# EAGLE schematic untitledfonte2 (EAGLE 6.2)
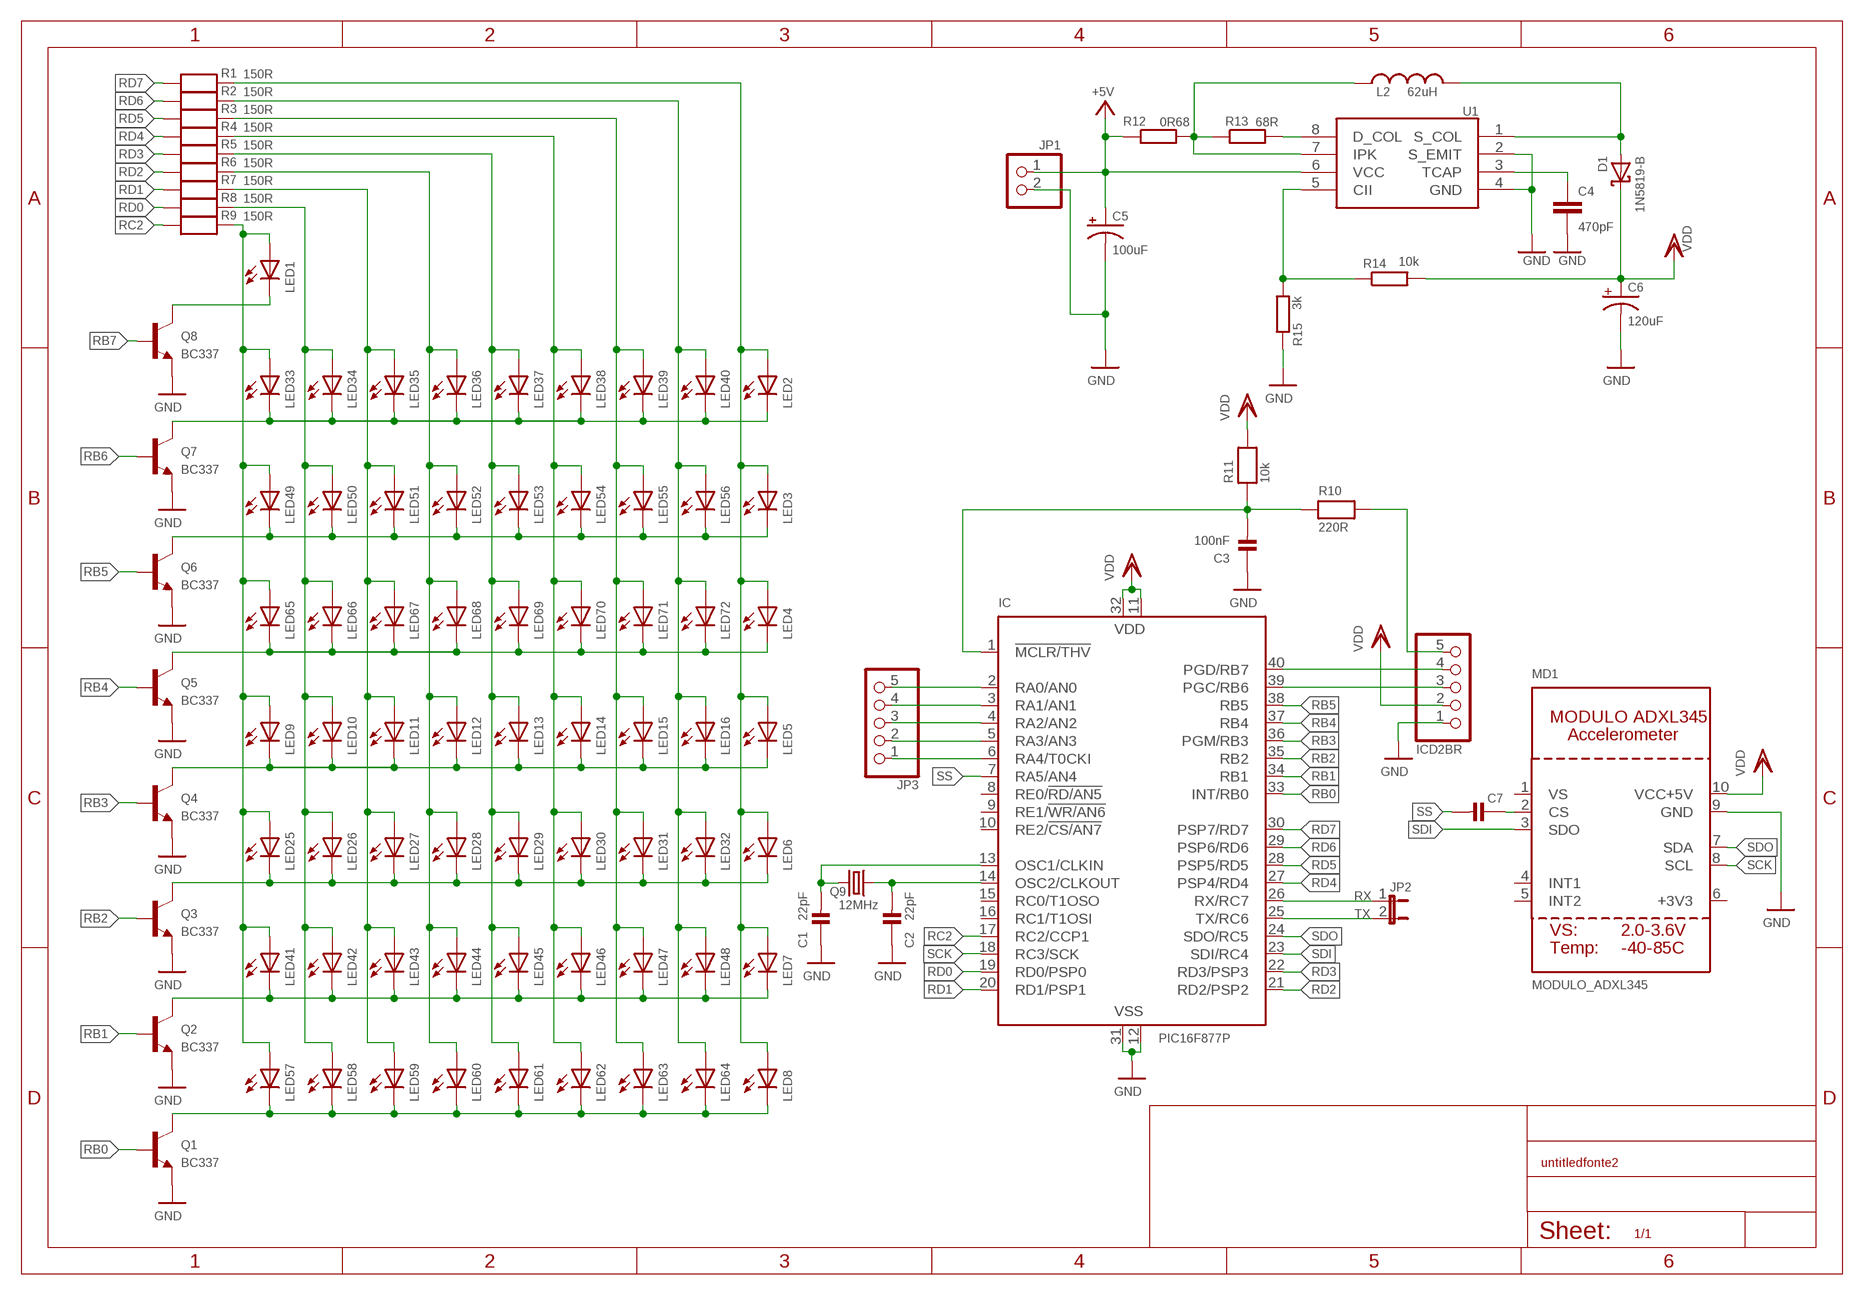
[diagram p0: schematic, sheet 1]

## Parts
C1  22pF  CAP_CERAMIC0805-NOTHERMALS  [0805_NOTHERMALS]
C2  22pF  CAP_CERAMIC0805-NOTHERMALS  [0805_NOTHERMALS]
C3  100nF  CAP_CERAMIC0805-NOTHERMALS  [0805_NOTHERMALS]
C4  470pF  C-EUC0805  [C0805]
C5  100uF  CPOL-USE2.5-5  [E2,5-5]
C6  120uF  CPOL-USE2.5-5  [E2,5-5]
C7  CAP_CERAMIC0805-NOTHERMALS  [0805_NOTHERMALS]
D1  1N5819-B  [DO41-7.6]
IC  PIC16F877P  [DIL40]
ICD2BR  HEADER-1X5ROUND  [1X05_ROUND]
JP1  HEADER-1X2  [1X02_OVAL]
JP2  JUMPER2  [JUMPER2]
JP3  HEADER-1X5ROUND  [1X05_ROUND]
L2  62uH  L-US0204/5  [0204/5]
LED1  LED3MM  [LED3MM]
LED2  LED3MM  [LED3MM]
LED3  LED3MM  [LED3MM]
LED4  LED3MM  [LED3MM]
LED5  LED3MM  [LED3MM]
LED6  LED3MM  [LED3MM]
LED7  LED3MM  [LED3MM]
LED8  LED3MM  [LED3MM]
LED9  LED3MM  [LED3MM]
LED10  LED3MM  [LED3MM]
LED11  LED3MM  [LED3MM]
LED12  LED3MM  [LED3MM]
LED13  LED3MM  [LED3MM]
LED14  LED3MM  [LED3MM]
LED15  LED3MM  [LED3MM]
LED16  LED3MM  [LED3MM]
LED25  LED3MM  [LED3MM]
LED26  LED3MM  [LED3MM]
LED27  LED3MM  [LED3MM]
LED28  LED3MM  [LED3MM]
LED29  LED3MM  [LED3MM]
LED30  LED3MM  [LED3MM]
LED31  LED3MM  [LED3MM]
LED32  LED3MM  [LED3MM]
LED33  LED3MM  [LED3MM]
LED34  LED3MM  [LED3MM]
LED35  LED3MM  [LED3MM]
LED36  LED3MM  [LED3MM]
LED37  LED3MM  [LED3MM]
LED38  LED3MM  [LED3MM]
LED39  LED3MM  [LED3MM]
LED40  LED3MM  [LED3MM]
LED41  LED3MM  [LED3MM]
LED42  LED3MM  [LED3MM]
LED43  LED3MM  [LED3MM]
LED44  LED3MM  [LED3MM]
LED45  LED3MM  [LED3MM]
LED46  LED3MM  [LED3MM]
LED47  LED3MM  [LED3MM]
LED48  LED3MM  [LED3MM]
LED49  LED3MM  [LED3MM]
LED50  LED3MM  [LED3MM]
LED51  LED3MM  [LED3MM]
LED52  LED3MM  [LED3MM]
LED53  LED3MM  [LED3MM]
LED54  LED3MM  [LED3MM]
LED55  LED3MM  [LED3MM]
LED56  LED3MM  [LED3MM]
LED57  LED3MM  [LED3MM]
LED58  LED3MM  [LED3MM]
LED59  LED3MM  [LED3MM]
LED60  LED3MM  [LED3MM]
LED61  LED3MM  [LED3MM]
LED62  LED3MM  [LED3MM]
LED63  LED3MM  [LED3MM]
LED64  LED3MM  [LED3MM]
LED65  LED3MM  [LED3MM]
LED66  LED3MM  [LED3MM]
LED67  LED3MM  [LED3MM]
LED68  LED3MM  [LED3MM]
LED69  LED3MM  [LED3MM]
LED70  LED3MM  [LED3MM]
LED71  LED3MM  [LED3MM]
LED72  LED3MM  [LED3MM]
MD1  MODULO_ADXL345  [MODULO_ADXL345]
Q1  BC337  [TO92]
Q2  BC337  [TO92]
Q3  BC337  [TO92]
Q4  BC337  [TO92]
Q5  BC337  [TO92]
Q6  BC337  [TO92]
Q7  BC337  [TO92]
Q8  BC337  [TO92]
Q9  12MHz  CRYSTALHC49S  [HC49/S]
R1  150R  RESISTOR0805_NOTHERMALS  [0805_NOTHERMALS]
R2  150R  RESISTOR0805_NOTHERMALS  [0805_NOTHERMALS]
R3  150R  RESISTOR0805_NOTHERMALS  [0805_NOTHERMALS]
R4  150R  RESISTOR0805_NOTHERMALS  [0805_NOTHERMALS]
R5  150R  RESISTOR0805_NOTHERMALS  [0805_NOTHERMALS]
R6  150R  RESISTOR0805_NOTHERMALS  [0805_NOTHERMALS]
R7  150R  RESISTOR0805_NOTHERMALS  [0805_NOTHERMALS]
R8  150R  RESISTOR0805_NOTHERMALS  [0805_NOTHERMALS]
R9  150R  RESISTOR0805_NOTHERMALS  [0805_NOTHERMALS]
R10  220R  RESISTOR0805_NOTHERMALS  [0805_NOTHERMALS]
R11  10k  RESISTOR0805_NOTHERMALS  [0805_NOTHERMALS]
R12  0R68  R-EU_0207/5V  [0207/5V]
R13  68R  R-EU_0207/2V  [0207/2V]
R14  10k  R-EU_0207/2V  [0207/2V]
R15  3k  R-EU_0207/2V  [0207/2V]
U1  MC34063A  [SOIC8_150MIL]

## Nets
1: D1.A L2.2 U1.1(S_COL)
3: C4.1 U1.3(TCAP)
5: R14.1 R15.2 U1.5(CII)
7: L2.1 R12.2 R13.1 U1.7(IPK)
8: R13.2 U1.8(D_COL)
+5V: C5.+ JP1.1 R12.1 U1.6(VCC)
GND: C1.1 C2.1 C3.1 C4.2 C5.- C6.- IC.12(VSS) IC.31(VSS) ICD2BR.1 JP1.2 MD1.9(GND) Q1.1(E) Q2.1(E) Q3.1(E) Q4.1(E) Q5.1(E) Q6.1(E) Q7.1(E) Q8.1(E) R15.1 U1.2(S_EMIT) U1.4(GND)
N$1: LED1.K(C) Q8.3(C)
N$2: C7.1 MD1.2(CS)
N$3: LED4.K(C) LED65.K(C) LED66.K(C) LED67.K(C) LED68.K(C) LED69.K(C) LED70.K(C) LED71.K(C) LED72.K(C) Q5.3(C)
N$4: LED3.K(C) LED49.K(C) LED50.K(C) LED51.K(C) LED52.K(C) LED53.K(C) LED54.K(C) LED55.K(C) LED56.K(C) Q6.3(C)
N$5: LED8.K(C) LED57.K(C) LED58.K(C) LED59.K(C) LED60.K(C) LED61.K(C) LED62.K(C) LED63.K(C) LED64.K(C) Q1.3(C)
N$6: LED7.K(C) LED41.K(C) LED42.K(C) LED43.K(C) LED44.K(C) LED45.K(C) LED46.K(C) LED47.K(C) LED48.K(C) Q2.3(C)
N$7: LED1.A LED9.A LED25.A LED33.A LED41.A LED49.A LED57.A LED65.A R9.2
N$8: LED10.A LED26.A LED34.A LED42.A LED50.A LED58.A LED66.A R8.2
N$9: LED11.A LED27.A LED35.A LED43.A LED51.A LED59.A LED67.A R7.2
N$10: LED12.A LED28.A LED36.A LED44.A LED52.A LED60.A LED68.A R6.2
N$11: LED2.K(C) LED33.K(C) LED34.K(C) LED35.K(C) LED36.K(C) LED37.K(C) LED38.K(C) LED39.K(C) LED40.K(C) Q7.3(C)
N$12: LED13.A LED29.A LED37.A LED45.A LED53.A LED61.A LED69.A R5.2
N$13: LED14.A LED30.A LED38.A LED46.A LED54.A LED62.A LED70.A R4.2
N$14: LED5.K(C) LED9.K(C) LED10.K(C) LED11.K(C) LED12.K(C) LED13.K(C) LED14.K(C) LED15.K(C) LED16.K(C) Q4.3(C)
N$15: LED15.A LED31.A LED39.A LED47.A LED55.A LED63.A LED71.A R3.2
N$16: LED16.A LED32.A LED40.A LED48.A LED56.A LED64.A LED72.A R2.2
N$17: LED2.A LED3.A LED4.A LED5.A LED6.A LED7.A LED8.A R1.2
N$18: IC.2(RA0/AN0) JP3.5
N$19: IC.3(RA1/AN1) JP3.4
N$20: IC.4(RA2/AN2) JP3.3
N$22: IC.5(RA3/AN3) JP3.2
N$23: IC.6(RA4/T0CKI) JP3.1
N$33: LED6.K(C) LED25.K(C) LED26.K(C) LED27.K(C) LED28.K(C) LED29.K(C) LED30.K(C) LED31.K(C) LED32.K(C) Q3.3(C)
N$36: C1.2 IC.13(OSC1/CLKIN) Q9.2
N$37: C2.2 IC.14(OSC2/CLKOUT) Q9.1
N$41: ICD2BR.5 R10.2
N$42: C3.2 IC.1(!MCLR/THV) R10.1 R11.1
RB0: IC.33(INT/RB0) Q1.2(B)
RB1: IC.34(RB1) Q2.2(B)
RB2: IC.35(RB2) Q3.2(B)
RB3: IC.36(PGM/RB3) Q4.2(B)
RB4: IC.37(RB4) Q5.2(B)
RB5: IC.38(RB5) Q6.2(B)
RB6: IC.39(PGC/RB6) ICD2BR.3 Q7.2(B)
RB7: IC.40(PGD/RB7) ICD2BR.4 Q8.2(B)
RC2: IC.17(RC2/CCP1) R9.1
RD0: IC.19(RD0/PSP0) R8.1
RD1: IC.20(RD1/PSP1) R7.1
RD2: IC.21(RD2/PSP2) R6.1
RD3: IC.22(RD3/PSP3) R5.1
RD4: IC.27(PSP4/RD4) R4.1
RD5: IC.28(PSP5/RD5) R3.1
RD6: IC.29(PSP6/RD6) R2.1
RD7: IC.30(PSP7/RD7) R1.1
RX: IC.26(RX/RC7) JP2.1
SCK: IC.18(RC3/SCK) MD1.8(SCL)
SDI: IC.23(SDI/RC4) MD1.3(SDO)
SDO: IC.24(SDO/RC5) MD1.7(SDA)
SS: C7.2 IC.7(RA5/AN4)
TX: IC.25(TX/RC6) JP2.2
VDD: C6.+ D1.C IC.11(VDD) IC.32(VDD) ICD2BR.2 MD1.10(VCC+5V) R11.2 R14.2
Unconnected: IC.8(RE0/!RD/AN5) IC.9(RE1/!WR/AN6) IC.10(RE2/!CS/AN7) IC.15(RC0/T1OSO) IC.16(RC1/T1OSI) MD1.1(VS) MD1.4(INT1) MD1.5(INT2) MD1.6(+3V3)

## Library data of the parts
C1-C3 C7 = junior:CAP_CERAMIC: Ceramic Capacitors 0402 - 0402 Surface Mount Capacitors 16pF 50V 5% [Digikey: 445-4899-2-ND] 18pF 50V 5% [Digikey: 490-1281-2-ND] 22pF 50V 5% [Digikey: 490-1283-2-ND] 68pF 50V 5% [Digikey: 490-1289-2-ND] 0.1uF 10V 10% [Digikey: 490-1318-2-ND] 1.0uF 6.3V 10% [Digikey: 490-1320-2-ND] 0603 - 0603 Surface Mount Capacitors 16 pF 50V 5% [Digikey: 445-5051-2-ND] 22 pF 50V [Digikey: PCC220ACVTR-ND] 33 pF 50V 5% [Digikey: 490-1415-1-ND] 56pF 50V 5% [Digikey: 490-1421-1-ND] 220pF 50V 5% [Digikey: 445-1285-1-ND] 680 pF 50V 2200 pF 50V 5% C0G [Digikey: 445-1297-1-ND] 5600 pF 100V 5% X7R [Digikey: 478-3711-1-ND] 0.1 µF 25V 10% [Digikey: PCC2277TR-ND] 0.22 µF 16V 10% X7R [Digikey: 445-1318-1-ND] 1.0 µF 25V 10% [Digikey: 445-5146-2-ND] 0603 - RF Specific 3pF 250V +/-0.1pF RF [Digikey: 712-1347-1-ND] 18 pF 250V 5% [Digikey: 478-3505-1-ND or 712-1322-1-ND] 56 pF 250V 5% C0G RF [Digikey: 490-4867-1-ND] 68 pF 250V RF [Digikey: 490-4868-1-ND] 0805 - 0805 Surface Mount Capacitors 220 pF 250V 2% RF Ceramic Capacitor [Digikey: 712-1398-1-ND] 1000 pF 50V 2% NP0 Ceramic Capacitor [Digikey: 478-3760-1-ND] 0.1 µF 25V 10% Ceramic Capacitor [Digikey: PCC1828TR-ND] 1.0 µF 16V 10% Ceramic Capacitor[Digikey: 490-1691-2-ND] 10.0 µF 10V 10% Ceramic Capacitor[Digikey: 709-1228-1-ND] 10.0 uF 16V 10% Ceramic Capacitor [Digikey: 478-5165-2-ND] 47 uF 6.3V 20% Ceramic Capacitor [Digikey: 587-1779-1-ND or 399-5506-1-ND] 1206 - 1206 Surface Mount Capacitors 47uF 10V 20% Ceramic Capacitor [Digikey: 490-5528-1-ND or 399-5508-1-ND or 445-6010-1-ND] 100uF 6.3V -20%, +80% Y5V Ceramic Capacitor (Digikey: 490-4512-1-ND, Mouser: 81-GRM31CF50J107ZE1L)
C4 = rcl:C-EU: CAPACITOR, European symbol
C5 C6 = rcl:CPOL-US: POLARIZED CAPACITOR, American symbol
D1 = diode:1N581*: 1.0A SCHOTTKY BARRIER RECTIFIER Source: http://www.diodes.com/datasheets/ds23001.pdf
IC = microchip:PIC16F87*: MICROCONTROLLER; MF: MICROCHIP; MPN: PIC16F877-04/P; OC_FARNELL: 9761349; OC_NEWARK: 61K3463
ICD2BR JP3 = junior:HEADER-1X5: PIN HEADER
JP1 = junior:HEADER-1X2: PIN HEADER
JP2 = junior:JUMPER2: JUMPER - 2 Pins
L2 = rcl:L-US: INDUCTOR, American symbol
LED1-LED16 LED25-LED72 = led:LED: LED OSRAM: - CHIPLED LG R971, LG N971, LY N971, LG Q971, LY Q971, LO R971, LY R971 LH N974, LH R974 LS Q976, LO Q976, LY Q976 LO Q996 - Hyper CHIPLED LW Q18S LB Q993, LB Q99A, LB R99A - SideLED LS A670, LO A670, LY A670, LG A670, LP A670 LB A673, LV A673, LT A673, LW A673 LH A674 LY A675 LS A676, LA A676, LO A676, LY A676, LW A676 LS A679, LY A679, LG A679 - Hyper Micro SIDELED® LS Y876, LA Y876, LO Y876, LY Y876 LT Y87S - SmartLED LW L88C, LW L88S LB L89C, LB L89S, LG L890 LS L89K, LO L89K, LY L89K LS L896, LA L896, LO L896, LY L896 - TOPLED LS T670, LO T670, LY T670, LG T670, LP T670 LSG T670, LSP T670, LSY T670, LOP T670, LYG T670 LG T671, LOG T671, LSG T671 LB T673, LV T673, LT T673, LW T673 LH T674 LS T676, LA T676, LO T676, LY T676, LB T676, LH T676, LSB T676, LW T676 LB T67C, LV T67C, LT T67C, LS T67K, LO T67K, LY T67K, LW E67C LS E67B, LA E67B, LO E67B, LY E67B, LB E67C, LV E67C, LT E67C LW T67C LS T679, LY T679, LG T679 LS T770, LO T770, LY T770, LG T770, LP T770 LB T773, LV T773, LT T773, LW T773 LH T774 LS E675, LA E675, LY E675, LS T675 LS T776, LA T776, LO T776, LY T776, LB T776 LHGB T686 LT T68C, LB T68C - Hyper Mini TOPLED® LB M676 - Mini TOPLED Santana® LG M470 LS M47K, LO M47K, LY M47K Source: http://www.osram.convergy.de LUXEON: - LUMILED® LXK2-PW12-R00, LXK2-PW12-S00, LXK2-PW14-U00, LXK2-PW14-V00 LXK2-PM12-R00, LXK2-PM12-S00, LXK2-PM14-U00 LXK2-PE12-Q00, LXK2-PE12-R00, LXK2-PE12-S00, LXK2-PE14-T00, LXK2-PE14-U00 LXK2-PB12-K00, LXK2-PB12-L00, LXK2-PB12-M00, LXK2-PB14-N00, LXK2-PB14-P00, LXK2-PB14-Q00 LXK2-PR12-L00, LXK2-PR12-M00, LXK2-PR14-Q00, LXK2-PR14-R00 LXK2-PD12-Q00, LXK2-PD12-R00, LXK2-PD12-S00 LXK2-PH12-R00, LXK2-PH12-S00 LXK2-PL12-P00, LXK2-PL12-Q00, LXK2-PL12-R00 Source: www.luxeon.com KINGBRIGHT: KA-3528ASYC Source: www.kingbright.com
MD1 = junior:MODULO_ADXL345
Q1-Q8 = transistor-npn:BC337*: NPN Transistor
Q9 = crystal:CRYSTAL: CRYSTAL; OC_FARNELL: 1667008; OC_NEWARK: unknown
R1-R11 = junior:RESISTOR: Resistors 0402 - 0402 Surface Mount Package 22 Ohm 1% 1/16W [Digikey: 311-22.0LRTR-ND] 33 Ohm 5% 1/16W 1.0K 5% 1/16W 1.5K 5% 1/16W 2.0K 1% 1/16W 10.0K 1% 1/16W [Digikey: 311-10.0KLRTR-ND] 10.0K 5% 1/16W [Digikey: RMCF0402JT10K0TR-ND] 12.1K 1% 1/16W [Digikey: 311-22.0LRTR-ND] 100.0K 5% 1/16W 0603 - 0603 Surface Mount Package 0 Ohm 1/10 Watt 1% Resistor 15 Ohm 1/10 Watt 1% Resistor 33 Ohm 1/10 Watt 1% Resistor 49.9 Ohm 1/10 Watt 1% Resistor 100 Ohm 1/10 Watt 1% Resistor 150 Ohm 1/10 Watt 1% Resistor 240 Ohm 1/10 Watt 1% Resistor 390 Ohm 1/10 Watt 1% Resistor 560 Ohm 1/10 Watt 1% Resistor 680 Ohm 1/10 Watt 1% Resistor 750 Ohm 1/10 Watt 1% Resistor 1.0K Ohm 1/10 Watt 1% Resistor 1.5K Ohm 1/10 Watt 1% Resistor 2.0K Ohm 1/10 Watt 1% Resistor 2.2K Ohm 1/10 Watt 1% Resistor 3.3K Ohm 1/10 Watt 1% Resistor 4.7K Ohm 1/10 Watt 1% Resistor 10.0K Ohm 1/10 Watt 1% Resistor 12.0K Ohm 1/10 Watt 1% Resistor 12.1K Ohm 1/10 Watt 1% Resistor 20.0K Ohm 1/10 Watt 1% Resistor 33.0K Ohm 1/10 Watt 1% Resistor 100.0K Ohm 1/10 Watt 1% Resistor 0805 - 0805 Surface Mount Package 0 Ohm 1/8 Watt 1% Resistor 33 Ohm 1/8 Watt 1% Resistor 100 Ohm 1/8 Watt 1% Resistor 150 Ohm 1/8 Watt 1% Resistor 200 Ohm 1/8 Watt 1% Resistor 240 Ohm 1/8 Watt 1% Resistor 330 Ohm 1/8 Watt 1% Resistor 390 Ohm 1/8 Watt 1% Resistor 470 Ohm 1/8 Watt 1% Resistor 1.0K Ohm 1/8 Watt 1% Resistor 1.5K Ohm 1/8 Watt 1% Resistor 2.0K Ohm 1/8 Watt 1% Resistor 4.7K Ohm 1/8 Watt 1% Resistor 5.1K Ohm 1/8 Watt 1% Resistor 5.6K Ohm 1/8 Watt 1% Resistor 10.0K Ohm 1/8 Watt 1% Resistor 22.0K Ohm 1/8 Watt 1% Resistor 33.0K Ohm 1/8 Watt 1% Resistor 100K Ohm 1/8 Watt 1% Resistor 1206 - 1206 Surface Mount Package 2012 - 2010 Surface Mount Package 0.11 Ohm 1/2 Watt 1% Resistor - Digikey: RHM.11UCT-ND
R12-R15 = rcl:R-EU_: RESISTOR, European symbol
U1 = microbuilder:MC34063A: MC34063A - 1.5A 3V-40V Boost/Buck/Inverting Voltage Regulator [Part No.] Allows you to 'boost', reduce or invert the voltage of your power supply to a more appropriate level. Common voltage regulators like the LM1117 are easy to use, but they can only 'reduce' the voltage level and require more volts than they provide, making them useless for low voltage power supplies like batteries or solar panels. A 'Step-Up' regulator like the MC34063A solves this problem by also allowing you to increase the voltage to a pre-determined level, though you still need to pay attention to the minimum voltage level the converter can handle, keeping in mind that many 'step-up' converts are less efficient at the two extreme ends of their working range. Given that many step-up circuits introduce some ripple to the power supply, you can often get a much 'smoother' supply by boosting the voltage up to 5.0V and then using a standard fixed voltage regulator (such as the common LM1117, etc.) to drop the voltage back down to 3.3V. This may not be necessary, and some step up regulators can provide a smooth supply on their own, but it's worth keeping in mind if you do encounter some ripple in the power supply using only a step-up IC for your power supply. Texas Instruments MC34063A Digikey: 296-17765-1-ND